# Altium schematic sheet VOUT_5-3V.SchDoc
size A4
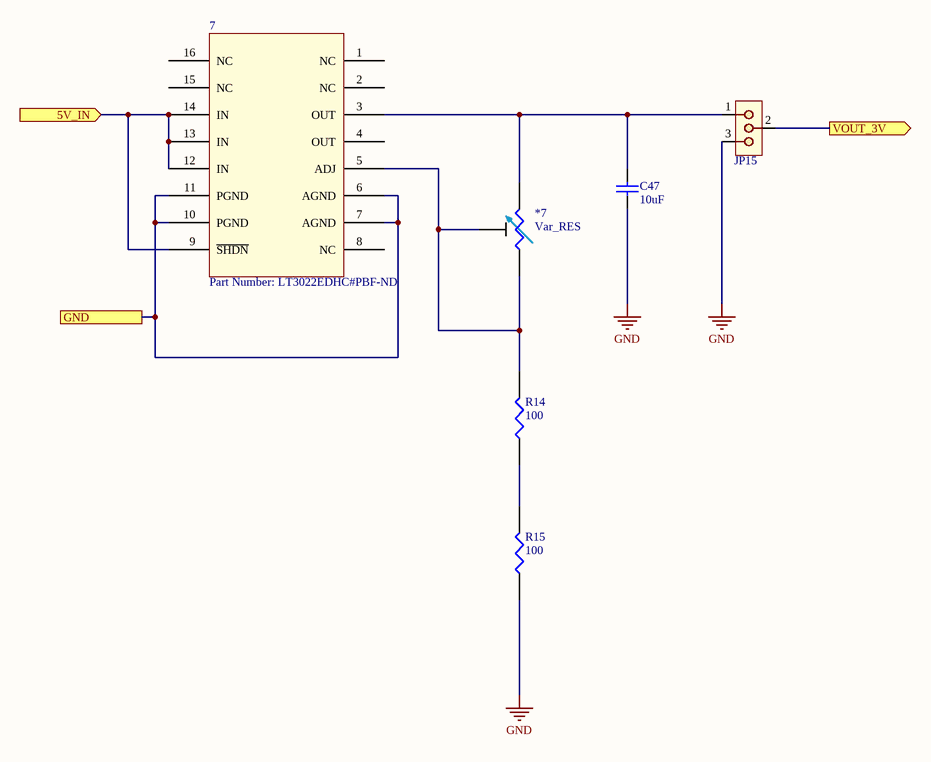
[diagram p0: VOUT_5-3V.SchDoc]

## Parts
7  Part Number: LT3022EDHC#PBF-ND  [LT3022]
*7  Var_RES  [res_var_5turn]
C47  10uF  [C0805]
JP15  Jumper  [01x03_0.1in_th_straight_b_nom]  (value not drawn)
R14  100  [R0805]
R15  100  [R0805]

## Ports
5V_IN (in), GND, VOUT_3V (out)

## Nets
GND: C47.1 JP15.3 R15.1
5V_IN: 7.9(~{SHDN}) 7.12(IN) 7.13(IN) 7.14(IN) ; port 5V_IN
GND: 7.6(AGND) 7.7(AGND) 7.10(PGND) 7.11(PGND) ; port GND  [a separate net that carries the same name]
VOUT_3V: JP15.2 ; port VOUT_3V
Net7_3: 7.3(OUT) *7.3 C47.2 JP15.1
Net7_5: 7.5(ADJ) *7.1 *7.2 R14.2
NetR14_1: R14.1 R15.2

Not connected (* = marked no-connect by the designer): 7 1(NC) 2(NC) 4(OUT) 8(NC) 15(NC) 16(NC)

## Library data of the parts
7 = LT3022: Linear Voltage Regulator IC Positive Adjustable 1 Output 1A 16-DFN (5x3)
C47 = Cap 10uF: Manufacturer: Taiyo Yuden; Manufacturer Part Number: UMK212SD103KD-T; Dielectric Material: Ceramic; Capacitance: 10nF; Tolerance: 10%; Voltage Rating: 50V; Supplier 1: Digi-Key; Stock 1: 14125; Pricing 1: 1=0.47, 10=0.323, 100=0.1941, 500=0.1455, 1000=0.1229 (USD); Mount: Surface Mount; Case/Package: 0805; Number of Pins: 2; Case Code (Metric): 2012; Case Code (Imperial): 0805; Min Operating Temperature: -55°C; Max Operating Temperature: 125°C; Packaging: Tape and Reel; Package Quantity: 1; Voltage Rating (DC): 50V; Termination: SMD/SMT; Length: 2mm; Height: 0.85mm; Width: 0.049inch; Thickness: 0.037inch; Depth: 1.25mm; Radiation Hardening: No; Lead Free: Lead Free; Halogen Free: Halogen Free; ComponentLink1URL: https://datasheet.ciiva.com/138/umk212sd103kd-t-ss-138661.pdf; ComponentLink1Description: https://datasheet.ciiva.com/138/umk212sd103kd-t-ss-138661.pdf; ComponentLink2URL: https://datasheet.ciiva.com/138/mlcc07-e-138662.pdf; ComponentLink2Description: https://datasheet.ciiva.com/138/mlcc07-e-138662.pdf; ComponentLink3URL: https://datasheet.ciiva.com/138/mlcc07-e-138663.pdf; ComponentLink3Description: https://datasheet.ciiva.com/138/mlcc07-e-138663.pdf; ComponentLink4URL: https://datasheet.ciiva.com/30140/303umk212sd103kd-t-30140925.pdf; ComponentLink4Description: https://datasheet.ciiva.com/30140/303umk212sd103kd-t-30140925.pdf; Supplier Part Number 1: 587-1114-1-ND
JP15 = Jumper-01x03: 01X03 generic terminal connector
R14 R15 = Res 100